# Altium project Logic_Or.PrjPcb
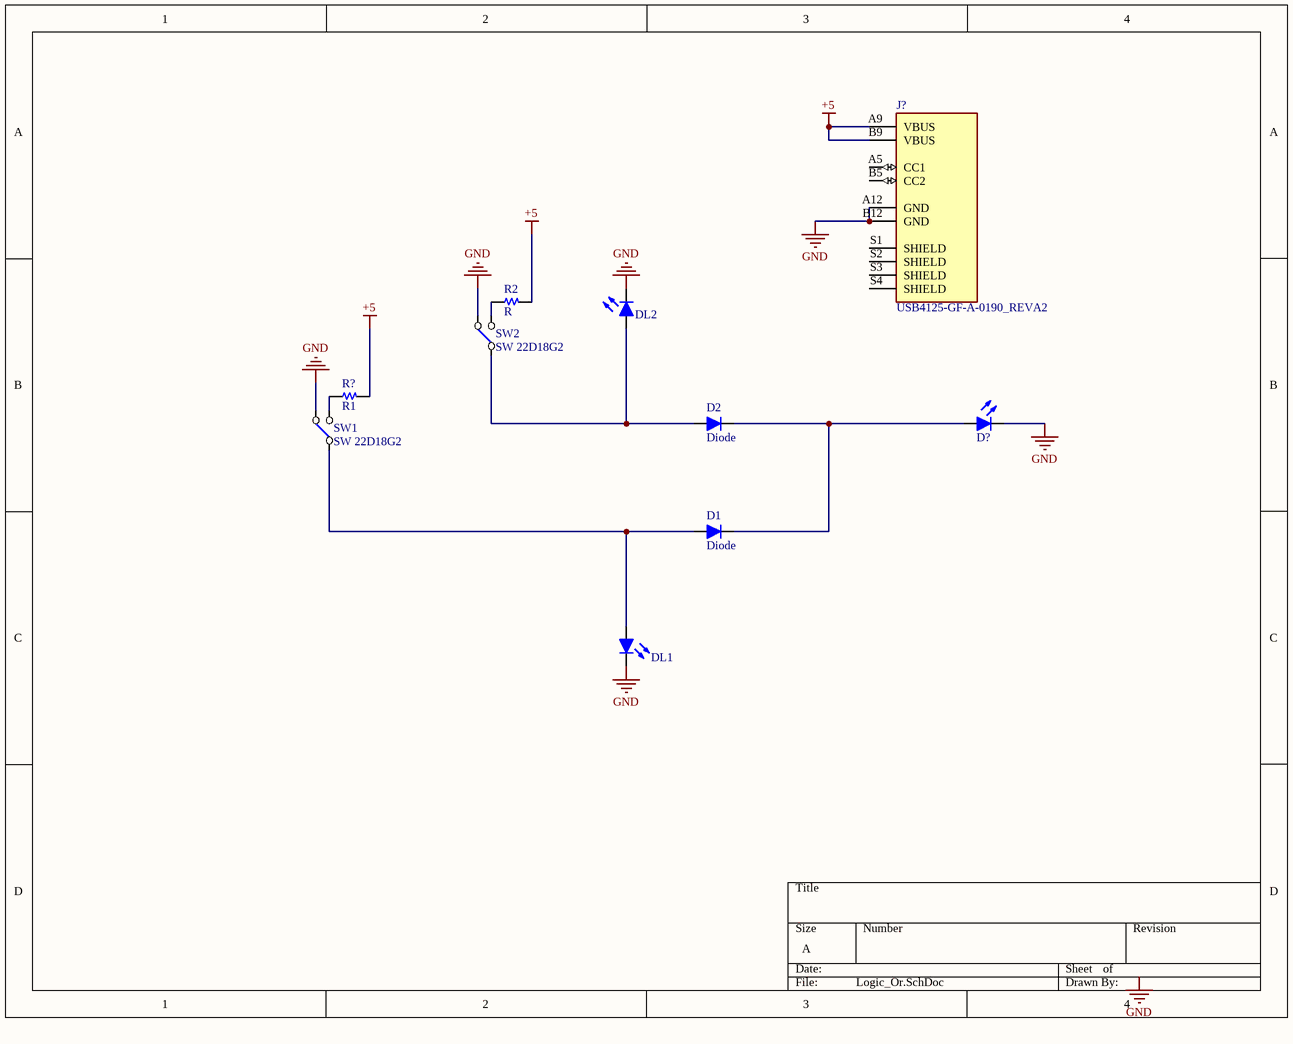
[diagram p0: Logic_Or.SchDoc]
1 sheet, 10 parts. Net scope: global (net labels, ports and power ports of the same name join across sheets).
Board file: PCB_Logic_Or.PcbDoc

## Sheet Logic_Or.SchDoc
size A; SheetNumber: 1; SheetTotal: 1

### Parts
D1  Diode  [DO-214AC (SMA)]
D2  Diode  [DO-214AC (SMA)]
D?  Led  [LED 3MM - green]  (value not drawn)
DL1  Led  [LED 3MM - red]  (value not drawn)
DL2  Led  [LED 3MM - red]  (value not drawn)
J?  USB4125-GF-A-0190_REVA2  [GCT_USB4125-GF-A-0190_REVA2]
R2  R  [R 0805]
R?  R1  [R 0805]
SW1  SW 22D18G2  [MST22D18G2]
SW2  SW 22D18G2  [MST22D18G2]

### Nets
+5: J?.A9(VBUS) J?.B9(VBUS) R2.2 R?.2
GND: D?.2(K) DL1.2(K) DL2.2(K) J?.A12(GND) J?.B12(GND) SW1.1(NC1) SW2.1(NC1)
NetD1_1: D1.1(A) DL1.1(A) SW1.2(COMMON1)
NetD1_2: D1.2(K) D2.2(K) D?.1(A)
NetD2_1: D2.1(A) DL2.1(A) SW2.2(COMMON1)
NetR2_1: R2.1 SW2.3(NO1)
NetR?_1: R?.1 SW1.3(NO1)

Not connected (* = marked no-connect by the designer): J? A5(CC1) B5(CC2) S1(SHIELD) S2(SHIELD) S3(SHIELD) S4(SHIELD)

### Notes on the sheet
- Labels drawn without touching a wire or pin: GND

### Library data of the parts
D1 D2 = Diode: Default Diode
D? DL1 DL2 = Led: Typical LED
J? = USB4125-GF-A-0190_REVA2: Type C Receptacle, Horizontal, SMT, For Power Charging Only; MF: Global Connector Technology; Price: None; Check_prices: https://www.snapeda.com/parts/USB4125-GF-A-0190/Global%20Connector%20Technology/view-part/6227012/?ref=eda; Package: None; Value: *; MP: USB4125-GF-A-0190; SnapEDA_Link: https://www.snapeda.com/parts/USB4125-GF-A-0190/Global%20Connector%20Technology/view-part/6227012/?ref=snap; Availability: No availability data
R2 R? = Resistor